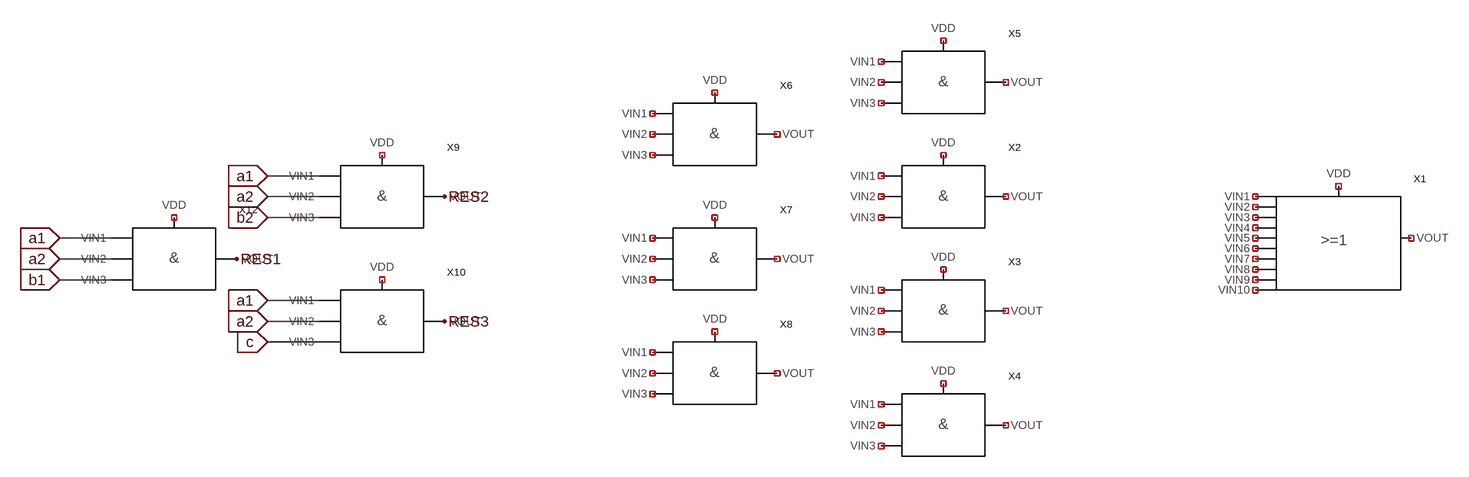
[diagram p0: schematic Draft1.asc]
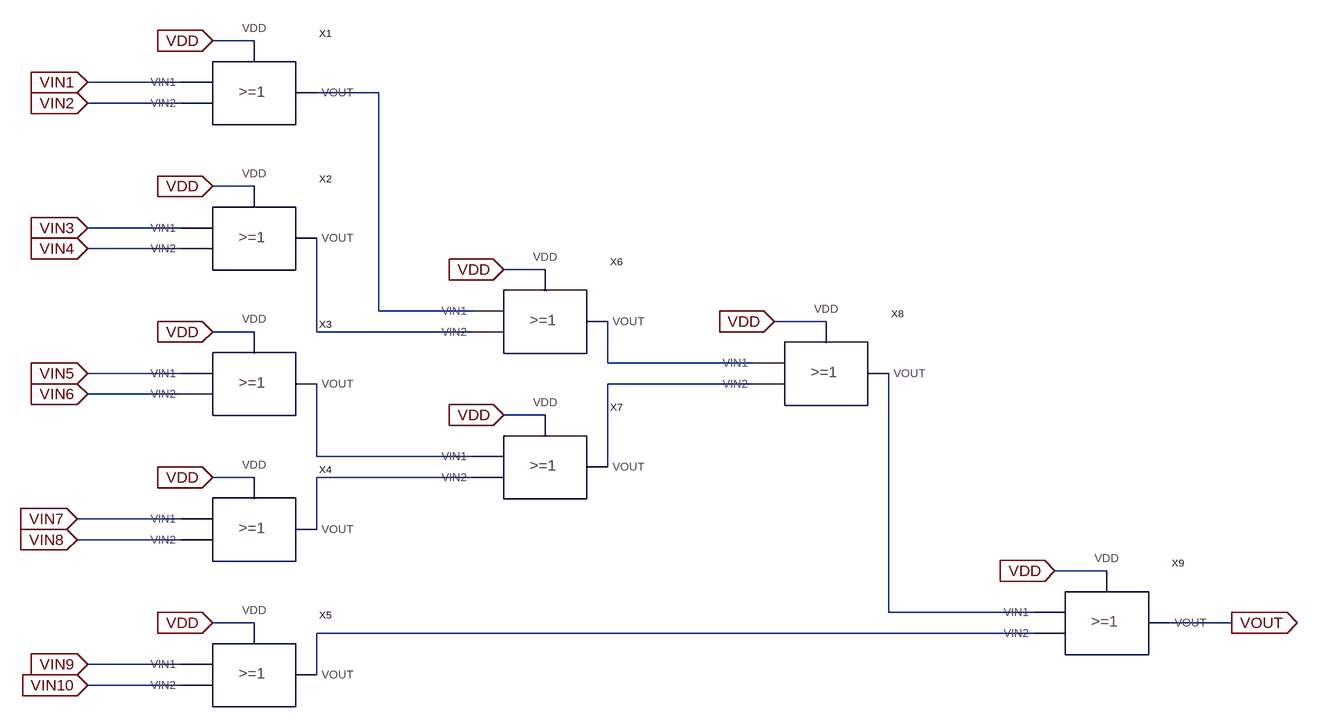
[diagram p1: sub-circuit dimatenor.asc]
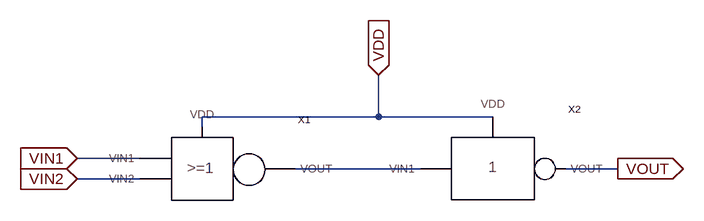
[diagram p2: sub-circuit dimaor.asc]
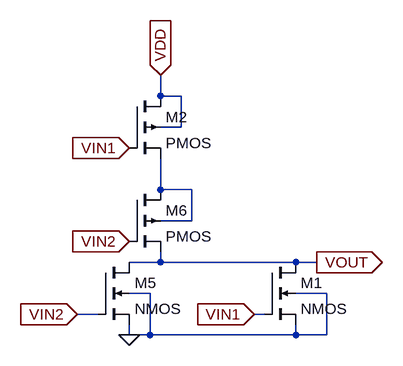
[diagram p3: sub-circuit dimanor.asc]
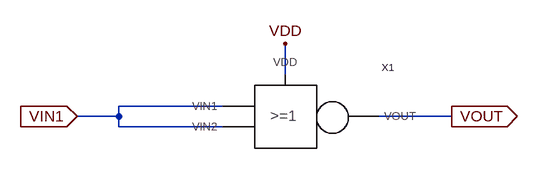
[diagram p4: sub-circuit dimanot.asc]
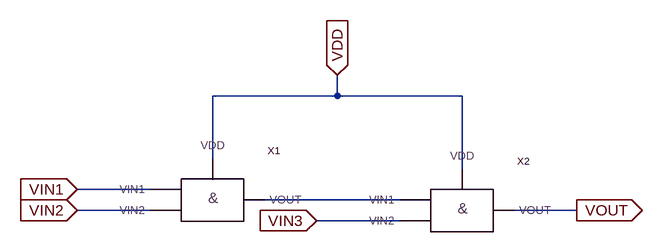
[diagram p5: sub-circuit dimatripleand.asc]
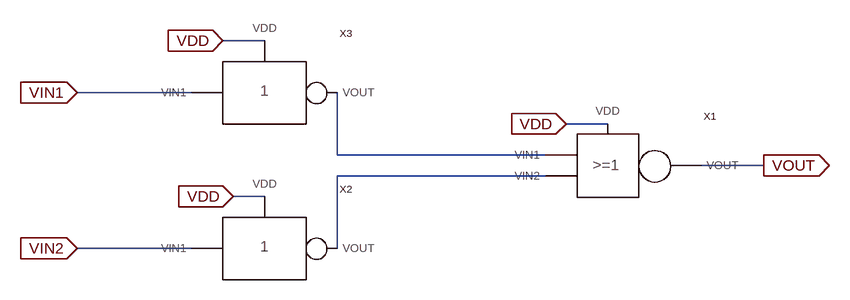
[diagram p6: sub-circuit dimaand.asc]
Draft1.asc, the LTspice schematic file:
Version 4
SHEET 1 880 680
WIRE -1296 64 -1376 64
WIRE -1296 96 -1376 96
WIRE -1296 128 -1376 128
WIRE -1616 160 -1696 160
WIRE -1616 192 -1696 192
WIRE -1616 224 -1696 224
WIRE -1296 256 -1376 256
WIRE -1296 288 -1376 288
WIRE -1296 320 -1376 320
FLAG -1696 160 a1
IOPIN -1696 160 In
FLAG -1696 192 a2
IOPIN -1696 192 In
FLAG -1696 224 b1
IOPIN -1696 224 In
FLAG -1424 192 RES1
FLAG -1104 96 RES2
FLAG -1376 64 a1
IOPIN -1376 64 In
FLAG -1376 96 a2
IOPIN -1376 96 In
FLAG -1376 128 b2
IOPIN -1376 128 In
FLAG -1376 256 a1
IOPIN -1376 256 In
FLAG -1376 288 a2
IOPIN -1376 288 In
FLAG -1376 320 c
IOPIN -1376 320 In
FLAG -1104 288 RES3
SYMBOL dimatenor 272 160 R0
SYMATTR InstName X1
SYMBOL dimatripleand -336 96 R0
SYMATTR InstName X2
SYMBOL dimatripleand -336 272 R0
SYMATTR InstName X3
SYMBOL dimatripleand -336 448 R0
SYMATTR InstName X4
SYMBOL dimatripleand -336 -80 R0
SYMATTR InstName X5
SYMBOL dimatripleand -688 0 R0
SYMATTR InstName X6
SYMBOL dimatripleand -688 192 R0
SYMATTR InstName X7
SYMBOL dimatripleand -688 368 R0
SYMATTR InstName X8
SYMBOL dimatripleand -1200 96 R0
SYMATTR InstName X9
SYMBOL dimatripleand -1200 288 R0
SYMATTR InstName X10
SYMBOL dimatripleand -1520 192 R0
SYMATTR InstName X12

dimatenor.asc, the sub-circuit schematic file:
Version 4
SHEET 1 1980 952
WIRE 336 -176 272 -176
WIRE 224 -112 80 -112
WIRE 528 -96 432 -96
WIRE 224 -80 80 -80
WIRE 336 48 272 48
WIRE 224 112 80 112
WIRE 224 144 80 144
WIRE 784 176 720 176
WIRE 528 240 528 -96
WIRE 672 240 528 240
WIRE 1216 256 1136 256
WIRE 336 272 272 272
WIRE 432 272 432 128
WIRE 672 272 432 272
WIRE 880 320 880 256
WIRE 1104 320 880 320
WIRE 224 336 80 336
WIRE 1104 352 880 352
WIRE 224 368 80 368
WIRE 784 400 720 400
WIRE 432 464 432 352
WIRE 672 464 432 464
WIRE 880 480 880 352
WIRE 336 496 272 496
WIRE 672 496 432 496
WIRE 224 560 64 560
WIRE 432 576 432 496
WIRE 224 592 64 592
WIRE 1648 640 1568 640
WIRE 1312 704 1312 336
WIRE 1536 704 1312 704
WIRE 336 720 272 720
WIRE 1840 720 1744 720
WIRE 1536 736 432 736
WIRE 224 784 80 784
WIRE 432 800 432 736
WIRE 224 816 80 816
FLAG 80 -112 VIN1
IOPIN 80 -112 In
FLAG 80 -80 VIN2
IOPIN 80 -80 In
FLAG 80 112 VIN3
IOPIN 80 112 In
FLAG 80 144 VIN4
IOPIN 80 144 In
FLAG 80 336 VIN5
IOPIN 80 336 In
FLAG 80 368 VIN6
IOPIN 80 368 In
FLAG 64 560 VIN7
IOPIN 64 560 In
FLAG 64 592 VIN8
IOPIN 64 592 In
FLAG 80 784 VIN9
IOPIN 80 784 In
FLAG 80 816 VIN10
IOPIN 80 816 In
FLAG 272 -176 VDD
IOPIN 272 -176 In
FLAG 1840 720 VOUT
IOPIN 1840 720 Out
FLAG 272 272 VDD
IOPIN 272 272 In
FLAG 272 496 VDD
IOPIN 272 496 In
FLAG 272 720 VDD
IOPIN 272 720 In
FLAG 720 400 VDD
IOPIN 720 400 In
FLAG 720 176 VDD
IOPIN 720 176 In
FLAG 1136 256 VDD
IOPIN 1136 256 In
FLAG 1568 640 VDD
IOPIN 1568 640 In
FLAG 272 48 VDD
IOPIN 272 48 In
SYMBOL dimaor 336 -96 R0
SYMATTR InstName X1
SYMBOL dimaor 336 128 R0
SYMATTR InstName X2
SYMBOL dimaor 336 352 R0
SYMATTR InstName X3
SYMBOL dimaor 336 576 R0
SYMATTR InstName X4
SYMBOL dimaor 336 800 R0
SYMATTR InstName X5
SYMBOL dimaor 784 256 R0
SYMATTR InstName X6
SYMBOL dimaor 784 480 R0
SYMATTR InstName X7
SYMBOL dimaor 1216 336 R0
SYMATTR InstName X8
SYMBOL dimaor 1648 720 R0
SYMATTR InstName X9

dimaor.asc, the sub-circuit schematic file:
Version 4
SHEET 1 880 680
WIRE 336 112 336 48
WIRE 336 112 64 112
WIRE 512 112 336 112
WIRE 64 128 64 112
WIRE -32 176 -128 176
WIRE 400 192 208 192
WIRE 704 192 624 192
WIRE -32 208 -128 208
FLAG 336 48 VDD
IOPIN 336 48 In
FLAG 704 192 VOUT
IOPIN 704 192 Out
FLAG -128 176 VIN1
IOPIN -128 176 In
FLAG -128 208 VIN2
IOPIN -128 208 In
SYMBOL dimanor 64 176 R0
SYMATTR InstName X1
SYMBOL dimanot 512 192 R0
SYMATTR InstName X2

dimanor.asc, the sub-circuit schematic file:
Version 4
SHEET 1 880 680
WIRE 464 64 464 32
WIRE 496 64 464 64
WIRE 496 112 496 64
WIRE 496 112 464 112
WIRE 464 208 464 160
WIRE 512 208 464 208
WIRE 512 256 512 208
WIRE 512 256 464 256
WIRE 464 320 464 304
WIRE 464 320 416 320
WIRE 672 320 464 320
WIRE 704 320 672 320
WIRE 448 368 416 368
WIRE 720 368 672 368
WIRE 368 400 336 400
WIRE 624 400 608 400
WIRE 416 432 416 416
WIRE 448 432 448 368
WIRE 448 432 416 432
WIRE 672 432 672 416
WIRE 672 432 448 432
WIRE 720 432 720 368
WIRE 720 432 672 432
FLAG 416 144 VIN1
IOPIN 416 144 In
FLAG 416 288 VIN2
IOPIN 416 288 In
FLAG 608 400 VIN1
IOPIN 608 400 In
FLAG 336 400 VIN2
IOPIN 336 400 In
FLAG 416 432 0
FLAG 464 32 VDD
IOPIN 464 32 In
FLAG 704 320 VOUT
IOPIN 704 320 Out
SYMBOL nmos4 368 320 R0
SYMATTR InstName M5
SYMATTR Value2 l=90n w=200n
SYMBOL nmos4 624 320 R0
SYMATTR InstName M1
SYMATTR Value2 l=90n w=200n
SYMBOL pmos4 416 64 R0
SYMATTR InstName M2
SYMATTR Value2 l=90n w=400n
SYMBOL pmos4 416 208 R0
SYMATTR InstName M6
SYMATTR Value2 l=90n w=400n

dimanot.asc, the sub-circuit schematic file:
Version 4
SHEET 1 880 680
WIRE 272 112 272 64
WIRE 176 160 16 160
WIRE 16 176 16 160
WIRE 16 176 -48 176
WIRE 528 176 416 176
WIRE 16 192 16 176
WIRE 176 192 16 192
FLAG -48 176 VIN1
IOPIN -48 176 In
FLAG 272 64 VDD
FLAG 528 176 VOUT
IOPIN 528 176 Out
SYMBOL dimanor 272 160 R0
SYMATTR InstName X1

dimatripleand.asc, the sub-circuit schematic file:
Version 4
SHEET 1 880 680
WIRE 256 0 256 -32
WIRE 256 0 64 0
WIRE 448 0 256 0
WIRE 64 96 64 0
WIRE 448 112 448 0
WIRE -32 144 -144 144
WIRE 352 160 144 160
WIRE -32 176 -144 176
WIRE 624 176 528 176
WIRE 352 192 224 192
FLAG 224 192 VIN3
IOPIN 224 192 In
FLAG -144 144 VIN1
IOPIN -144 144 In
FLAG -144 176 VIN2
IOPIN -144 176 In
FLAG 256 -32 VDD
IOPIN 256 -32 In
FLAG 624 176 VOUT
IOPIN 624 176 Out
SYMBOL dimaand 64 160 R0
SYMATTR InstName X1
SYMBOL dimaand 448 176 R0
SYMATTR InstName X2

dimaand.asc, the sub-circuit schematic file:
Version 4
SHEET 1 880 680
WIRE -176 0 -240 0
WIRE -288 80 -464 80
WIRE 352 128 288 128
WIRE -64 176 -64 80
WIRE 256 176 -64 176
WIRE 592 192 496 192
WIRE 256 208 -64 208
WIRE -176 240 -224 240
WIRE -288 320 -464 320
WIRE -64 320 -64 208
FLAG -240 0 VDD
IOPIN -240 0 In
FLAG -464 320 VIN2
IOPIN -464 320 In
FLAG -464 80 VIN1
IOPIN -464 80 In
FLAG 592 192 VOUT
IOPIN 592 192 Out
FLAG 288 128 VDD
IOPIN 288 128 In
FLAG -224 240 VDD
IOPIN -224 240 In
SYMBOL dimanor 352 176 R0
SYMATTR InstName X1
SYMBOL dimanot -176 320 R0
SYMATTR InstName X2
SYMBOL dimanot -176 80 R0
SYMATTR InstName X3

The netlist it stands for:
* Draft1.asc
XX1 NC_01 NC_02 NC_03 NC_04 NC_05 NC_06 NC_07 NC_08 NC_09 NC_10 NC_11 NC_12 dimatenor
XX2 NC_13 NC_14 NC_15 NC_16 NC_17 dimatripleand
XX3 NC_18 NC_19 NC_20 NC_21 NC_22 dimatripleand
XX4 NC_23 NC_24 NC_25 NC_26 NC_27 dimatripleand
XX5 NC_28 NC_29 NC_30 NC_31 NC_32 dimatripleand
XX6 NC_33 NC_34 NC_35 NC_36 NC_37 dimatripleand
XX7 NC_38 NC_39 NC_40 NC_41 NC_42 dimatripleand
XX8 NC_43 NC_44 NC_45 NC_46 NC_47 dimatripleand
XX9 a1 a2 b2 NC_48 RES2 dimatripleand
XX10 a1 a2 c NC_49 RES3 dimatripleand
XX12 a1 a2 b1 NC_50 RES1 dimatripleand

* block symbol definitions
.subckt dimatenor VOUT VDD VIN1 VIN2 VIN3 VIN4 VIN5 VIN6 VIN7 VIN8 VIN9 VIN10
XX1 VIN1 VIN2 VDD N001 dimaor
XX2 VIN3 VIN4 VDD N002 dimaor
XX3 VIN5 VIN6 VDD N005 dimaor
XX4 VIN7 VIN8 VDD N006 dimaor
XX5 VIN9 VIN10 VDD N008 dimaor
XX6 N001 N002 VDD N003 dimaor
XX7 N005 N006 VDD N004 dimaor
XX8 N003 N004 VDD N007 dimaor
XX9 N007 N008 VDD VOUT dimaor
.ends dimatenor

.subckt dimaor VIN1 VIN2 VDD VOUT
XX1 VIN1 VIN2 VDD N001 dimanor
XX2 N001 VDD VOUT dimanot
.ends dimaor

.subckt dimanor VIN1 VIN2 VDD VOUT
M5 VOUT VIN2 0 0 NMOS l=90n w=200n
M1 VOUT VIN1 0 0 NMOS l=90n w=200n
M2 VDD VIN1 N001 VDD PMOS l=90n w=400n
M6 N001 VIN2 VOUT N001 PMOS l=90n w=400n
.ends dimanor

.subckt dimanot VIN1 VDD VOUT
XX1 VIN1 VIN1 VDD VOUT dimanor
.ends dimanot

.subckt dimatripleand VIN1 VIN2 VIN3 VDD VOUT
XX1 VIN1 VIN2 VDD N001 dimaand
XX2 N001 VIN3 VDD VOUT dimaand
.ends dimatripleand

.subckt dimaand VIN1 VIN2 VDD VOUT
XX1 N001 N002 VDD VOUT dimanor
XX2 VIN2 VDD N002 dimanot
XX3 VIN1 VDD N001 dimanot
.ends dimaand

.model NMOS NMOS
.model PMOS PMOS
.lib standard.mos
.backanno
.end